# Altium project Trusters plate.PrjPcb
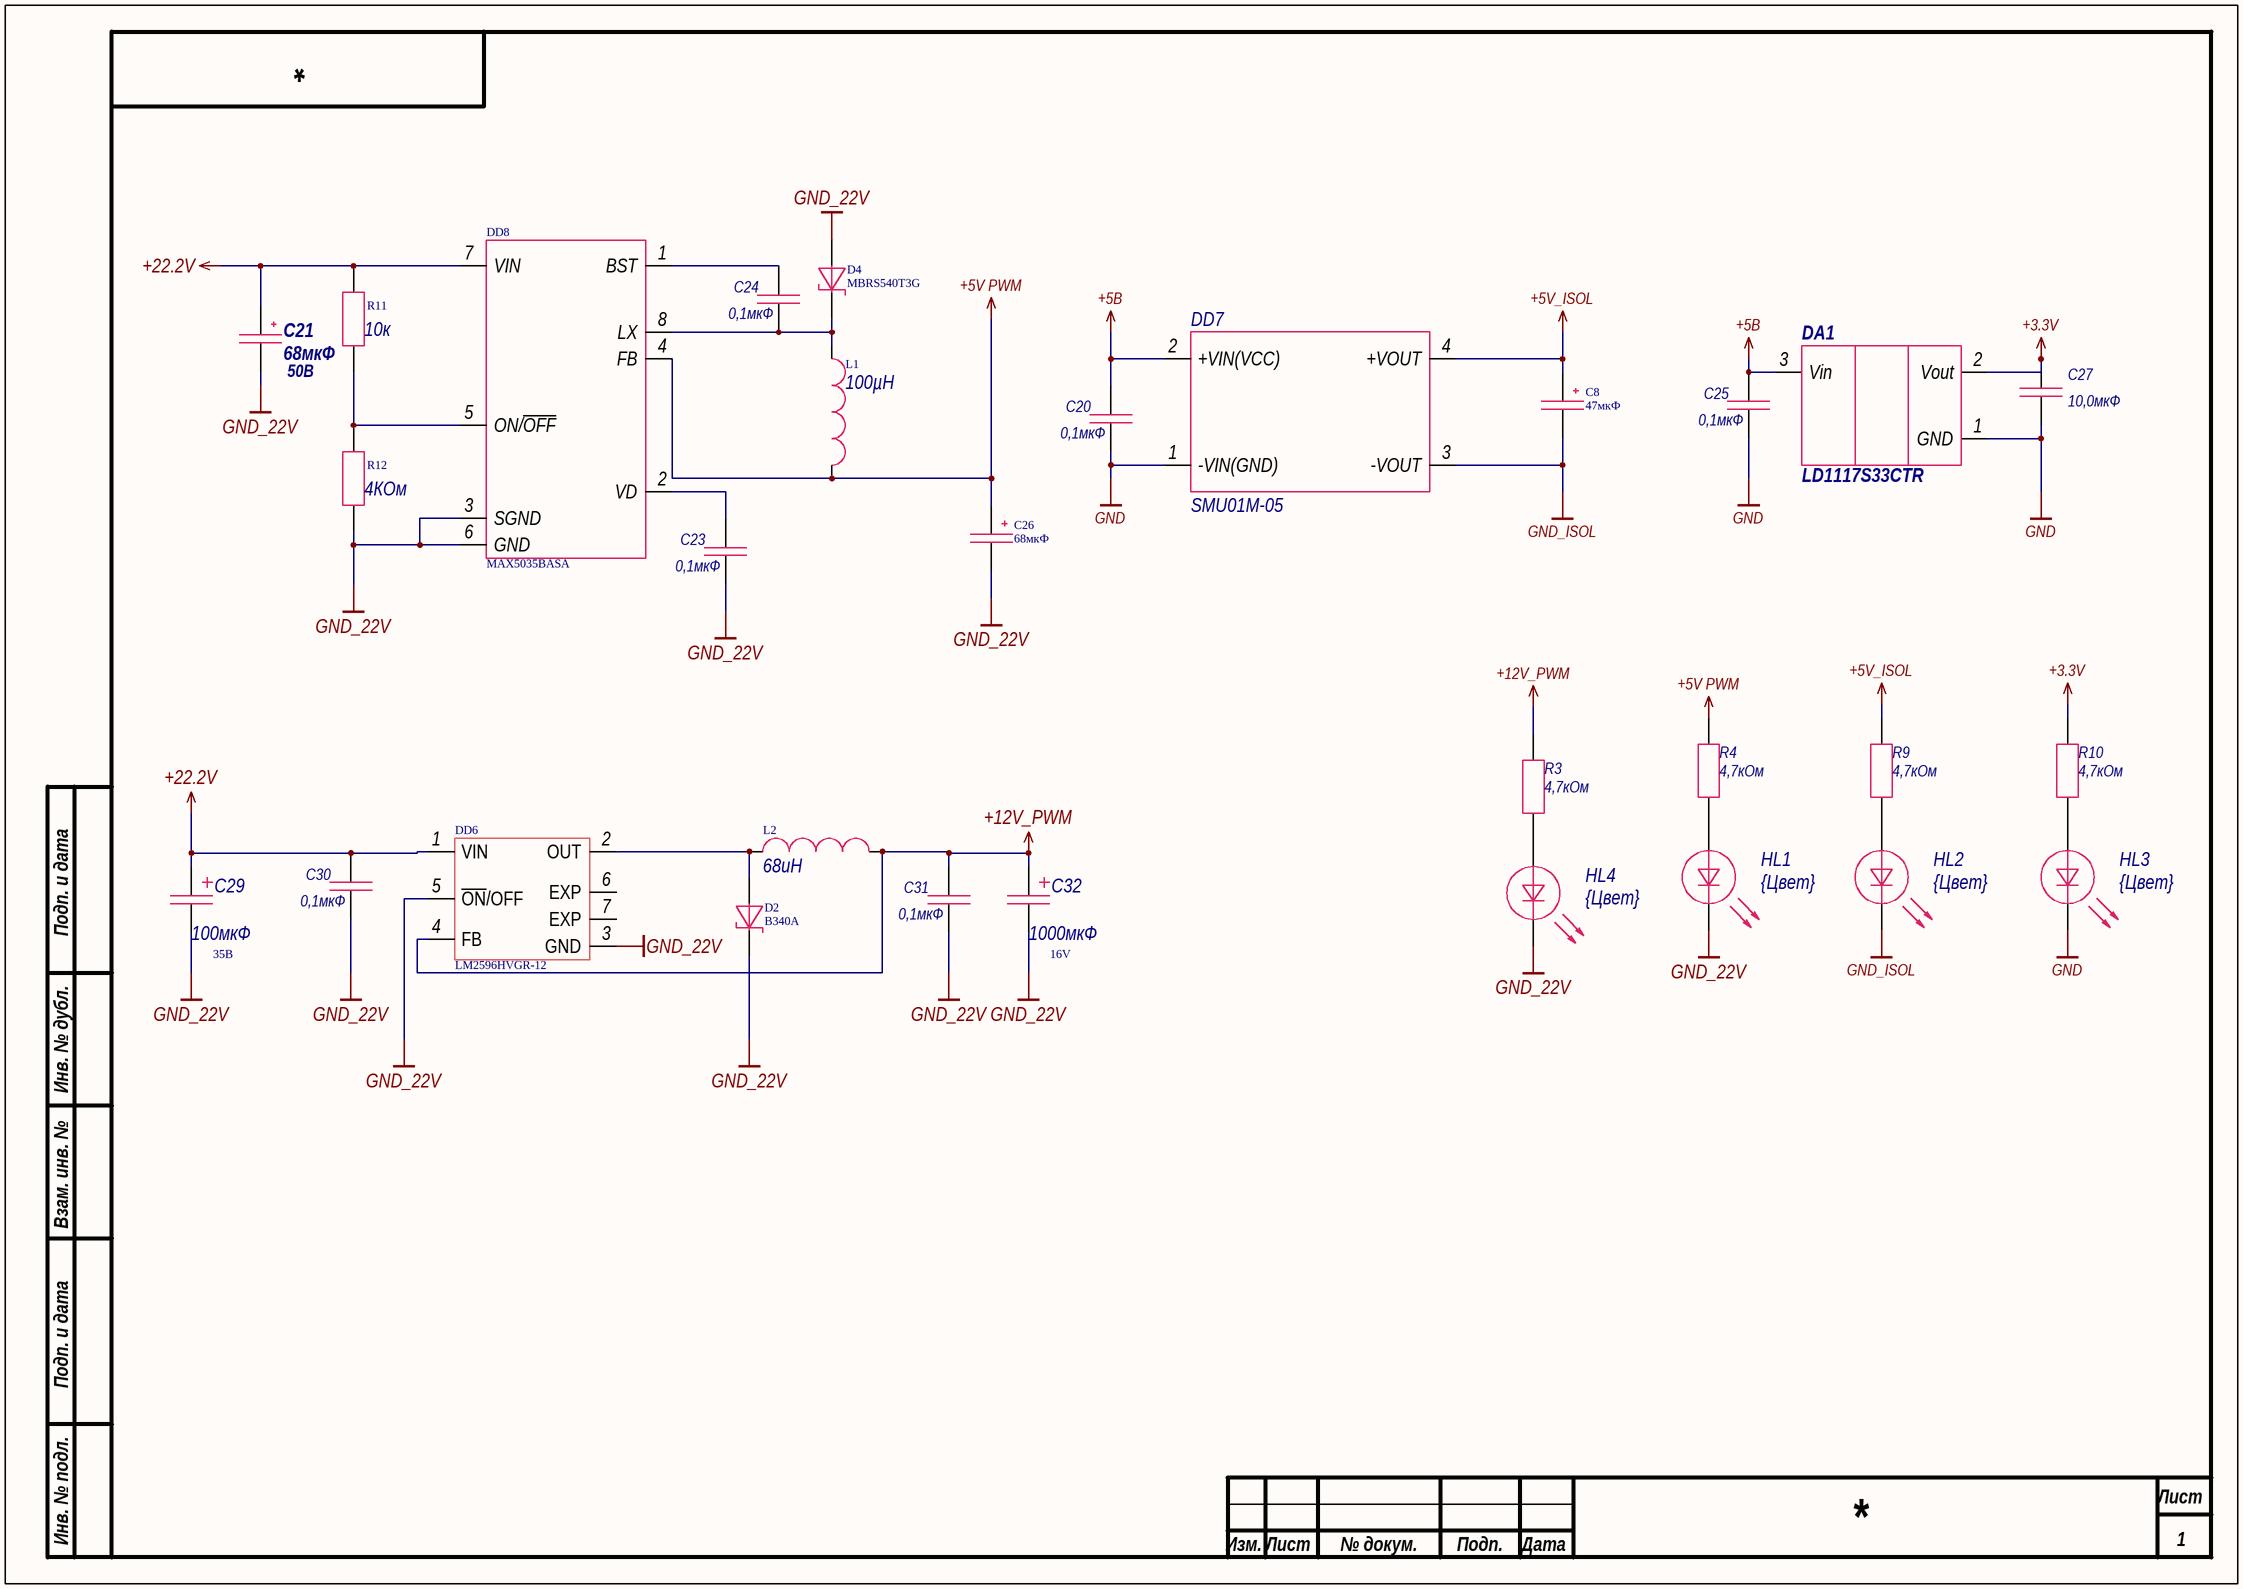
[diagram p0: power.SchDoc]
3 sheets, 101 parts. Net scope: flat (ports and power ports of the same name join across sheets).
Board file: thrusters.PcbDoc
Sheets:
  power.SchDoc
  conn.SchDoc
  mcu.SchDoc

## Sheet power.SchDoc
size 420 x 297 mm; SheetNumber: 1; SheetTotal: 3

### Parts
C8  47мкФ  [TC_B (3528)]
C20  value 0,1мкФ  [0603C]  (hidden comment: Capacitor)
C21  value 68мкФ  Parameter 1: 50В  [CAPPR65-350-1150X800X1250]  (hidden comment: 100uF)
C23  value 0,1мкФ  [0603C]  (hidden comment: Capacitor)
C24  value 0,1мкФ  [0603C]  (hidden comment: Capacitor)
C25  value 0,1мкФ  [0603C]  (hidden comment: Capacitor)
C26  68мкФ  [TC_D (7343)]
C27  value 10,0мкФ  [0603C]  (hidden comment: Capacitor)
C29  value 100мкФ  Rate: 35В  [THD12.5.25]  (hidden comment: 1uF)
C30  value 0,1мкФ  [0603C]  (hidden comment: Capacitor)
C31  value 0,1мкФ  [0603C]  (hidden comment: Capacitor)
C32  value 1000мкФ  Rate: 16V  [THD12.5.25]  (hidden comment: 1uF)
D2  B340A  [DIOM4326X23M]
D4  MBRS540T3G  [ONSC-SMC-2-403-03_V]
DA1  value LD1117S33CTR  [SOT223]  (hidden comment: LD1117S33)
DD6  LM2596HVGR-12  [VREG_LM2596S-3.3]
DD7  SMU01M-05  [DC-DC 5-5]
DD8  MAX5035BASA  [S8+5_L]
HL1  Color: {Цвет}  [0805D]
HL2  Color: {Цвет}  [0805D]
HL3  Color: {Цвет}  [0805D]
HL4  Color: {Цвет}  [0805D]
L1  value 100µH  [IND_VLS4012CX_4X4_TDK]  (hidden comment: Inductance)
L2  value 68uH  [IND_LQH32CN680K53L]  (hidden comment: Inductance)
R3  value 4,7кОм  [0603R]  (hidden comment: Resistor)
R4  value 4,7кОм  [0603R]  (hidden comment: Resistor)
R9  value 4,7кОм  [0603R]  (hidden comment: Resistor)
R10  value 4,7кОм  [0603R]  (hidden comment: Resistor)
R11  value 10к  [0805R]  (hidden comment: Resistor)
R12  value 4КОм  [0805R]  (hidden comment: Resistor)

### Nets
+3.3V: C27.1 DA1.2(Vout) R10.1
+5V PWM: C26.1 DD8.4(FB) L1.2 R4.1
+5V_ISOL: C8.1 DD7.4(+VOUT) R9.1
+5В: C20.1 C25.1 DA1.3(Vin) DD7.2(+VIN(VCC))
+12V_PWM: C31.1 C32.1 DD6.4(FB) L2.2 R3.1
+22.2V: C21.1 C29.1 C30.1 DD6.1(VIN) DD8.7(VIN) R11.2
GND: C20.2 C25.2 C27.2 DA1.1(GND) DD7.1(-VIN(GND)) HL3.2
GND_22V: C21.2 C23.2 C26.2 C29.2 C30.2 C31.2 C32.2 D2.2 D4.1 DD6.3(GND) DD6.5(~{ON}/OFF) DD8.3(SGND) DD8.6(GND) HL1.2 HL4.2 R12.1
GND_ISOL: C8.2 DD7.3(-VOUT) HL2.2
NetC23_1: C23.1 DD8.2(VD)
NetC24_1: C24.1 DD8.1(BST)
NetC24_2: C24.2 D4.2 DD8.8(LX) L1.1
NetD2_1: D2.1 DD6.2(OUT) L2.1
NetDD8_5: DD8.5(ON/~{OFF}) R11.1 R12.2
NetHL1_1: HL1.1 R4.2
NetHL2_1: HL2.1 R9.2
NetHL3_1: HL3.1 R10.2
NetHL4_1: HL4.1 R3.2

Not connected (* = marked no-connect by the designer): DD6 6(EXP) 7(EXP)

### Notes on the sheet
- Подп. и дата
- Инв. № дубл.
- Взам. инв. №
- Инв. № подл.
- Лист
- Изм.
- № докум.
- Подп.
- Дата

### Library data of the parts
C8 C26 = Capacitor_pol: Value: {Номинал}; Shop: https://www.chipdip.ru/product/tecap-68-mkf-10-v-tip-d-10-2
C21 = Capacitor_pol_100uF: Shop: https://www.chipdip.ru/product0/9000565885
C29 C32 = Capacitor_pol
  C29: Shop: https://www.chipdip.ru/product0/9000261772
  C32: Shop: https://www.chipdip.ru/product0/8007171953
D2 = CMP-1055-00390-1: Schottky Power Rectifier, 2-Pin SMC, Pb-Free, Tape and Reel; Manufacturer: On Semiconductor; PartNumber: MBRS540T3G; IFSM Max (A): 190; Shop: https://www.chipdip.ru/product/b340a; ComponentLink1URL: http://www.onsemi.com/; ComponentLink3URL: http://www.onsemi.com/pub_link/Collateral/403-03.PDF; ComponentLink1Description: Manufacturer URL; PackageVersion: Rev. E, 08/2005; Packing: Tape and Reel; ComponentLink2URL: http://www.onsemi.cn/pub_link/Collateral/MBRS540T3-D.PDF; RoHS: TRUE; DatasheetVersion: Rev. 8; Mounting Technology: Surface Mount; ComponentLink3Description: Package Specification; ComponentLink2Description: Datasheet; PackageDescription: 2-Pin Small Molded Package, J-Bend Lead, Body 5.845 x 6.855 mm; PackageReference: SMC-2-403-03
D4 = CMP-1055-00390-1: Schottky Power Rectifier, 2-Pin SMC, Pb-Free, Tape and Reel; Manufacturer: On Semiconductor; Configuration: Single; IFSM Max (A): 190; ComponentLink1URL: http://www.onsemi.com/; ComponentLink3URL: http://www.onsemi.com/pub_link/Collateral/403-03.PDF; ComponentLink1Description: Manufacturer URL; PackageVersion: Rev. E, 08/2005; Packing: Tape and Reel; ComponentLink2URL: http://www.onsemi.cn/pub_link/Collateral/MBRS540T3-D.PDF; RoHS: TRUE; DatasheetVersion: Rev. 8; Mounting Technology: Surface Mount; ComponentLink3Description: Package Specification; ComponentLink2Description: Datasheet; PartNumber: MBRS540T3G; PackageDescription: 2-Pin Small Molded Package, J-Bend Lead, Body 5.845 x 6.855 mm; PackageReference: SMC-2-403-03
DA1 = LD1117S33: Manufacturer: ST Microelectronics; Notice: Стабилизатор напряжения 3,3В; Rate: 0...15В; Datasheet: https://lib.chipdip.ru/168/DOC001168686.pdf; Shop: https://www.chipdip.ru/product/ld1117v33; Case: SOT223
DD6 = LM2596HVGR-12: MF: Texas Instruments; MP: LM2596S-3.3; Shop: https://www.chipdip.ru/product/lm2596hvgr-12; SnapEDA_Link: https://www.snapeda.com/parts/LM2596S-3.3/Texas+Instruments/view-part/?ref=snap; Availability: In Stock; Value: *; Price: None; Package: TO-263-5 Texas Instruments; Purchase-URL: https://pricing.snapeda.com/search/part/LM2596S-3.3/?ref=eda
DD7 = SMU01L-05: DC/DC преобразователь, 1Вт, вход 4.5-5.5В, выход 5В/200мА; MP: TME_1212S; Value: *; Availability: Unavailable; Price: None; Package: None
DD8 = MAX5035BASA+T: 1A, 76V, High-Efficiency MAXPower Step-Down DC-DC Converter, 5V output, 8-Pin SOIC, -40°C to +125°C, Pb-Free; ComponentLink2Description: Datasheet; Code_IPC: SOIC127P600-8; PackageDescription: 8-Pin Small-Outline IC, Narrow (0.15in), 1.27 mm Pitch, SOIC (N), Pb-Free; ComponentLink1URL: http://www.maxim-ic.com; PackageVersion: revC, 2010; Code_JEDEC: MS-012-AA; ComponentLink3URL: http://pdfserv.maxim-ic.com/package_dwgs/21-0041.PDF; DatasheetVersion: Rev 5, May-2011; ComponentLink2URL: http://datasheets.maxim-ic.com/en/ds/MAX5035.pdf; PackageReference: S8+5; ComponentLink1Description: Manufacturer URL; ComponentLink3Description: Package Specification
HL1-HL4 = LED: Manufacturer: -; Rate: -; Datasheet: -; Shop: -; Notice: -; Case: -
L1 L2 = Inductance
  L2: Shop: https://www.chipdip.ru/product0/8009279023

## Sheet conn.SchDoc
size A3; SheetNumber: 2; SheetTotal: 3
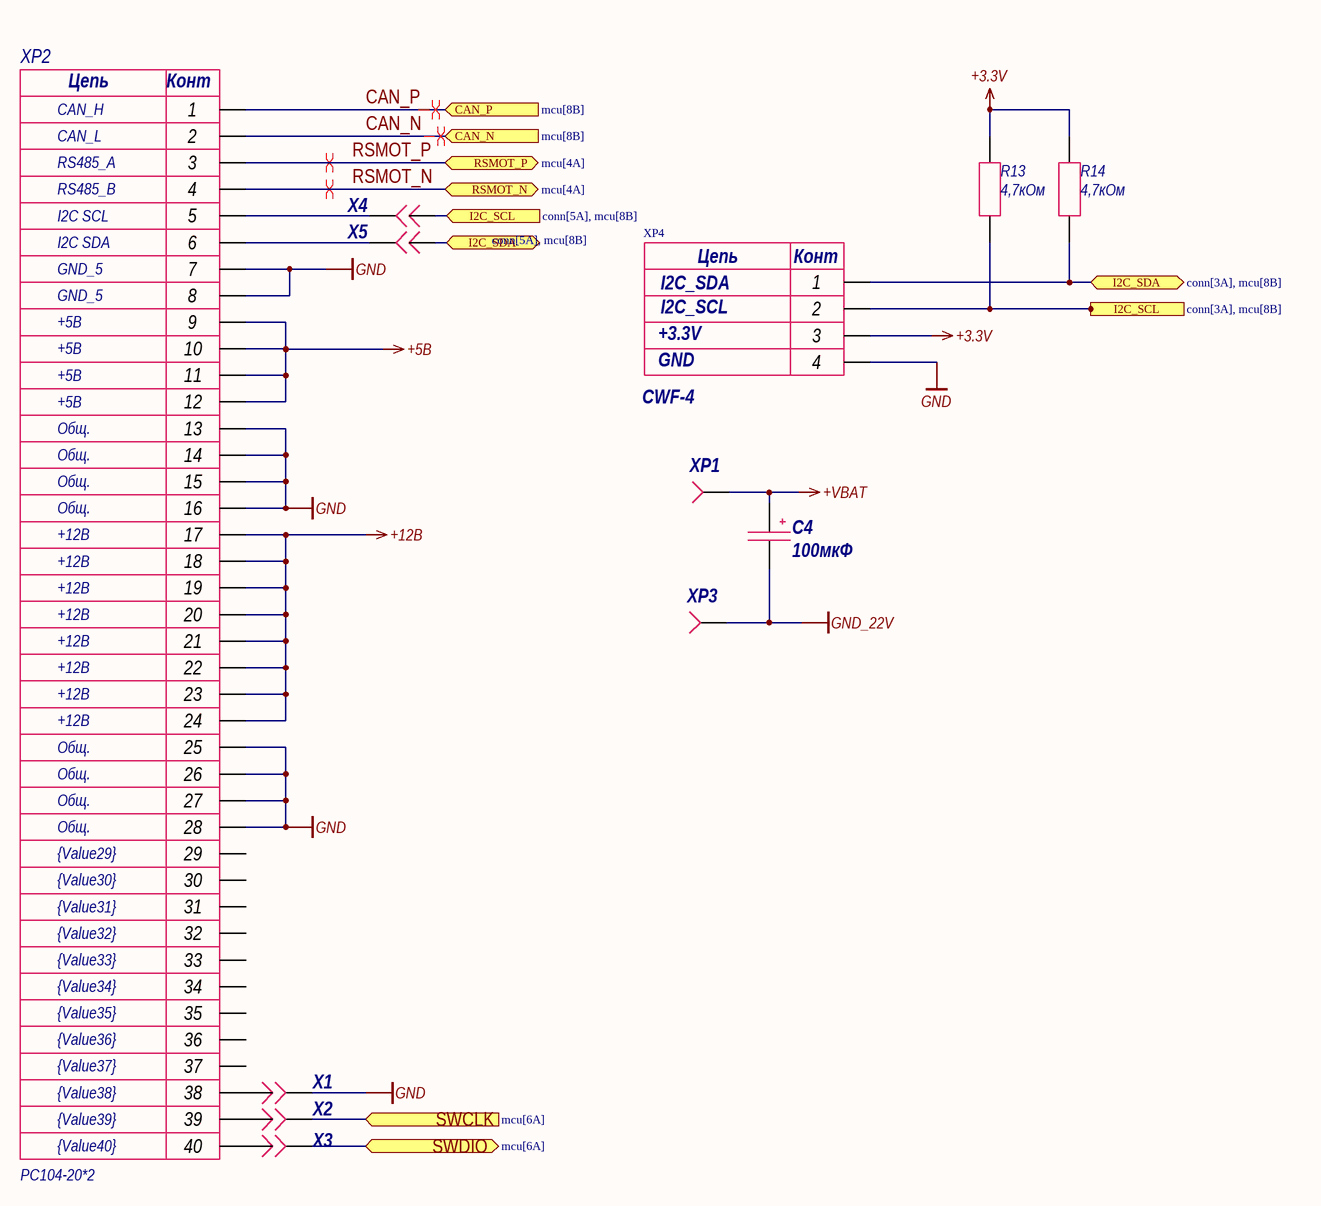
[diagram p1: conn.SchDoc]

### Parts
C4  value 100мкФ  [CAPPR65-350-1150X800X1250]  (hidden comment: 100uF)
R13  value 4,7кОм  [0603R]  (hidden comment: Resistor)
R14  value 4,7кОм  [0603R]  (hidden comment: Resistor)
X1  Jumper  [Fused Jumper]  (value not drawn)
X2  Jumper  [Fused Jumper]  (value not drawn)
X3  Jumper  [Fused Jumper]  (value not drawn)
X4  Jumper  [Fused Jumper]  (value not drawn)
X5  Jumper  [Fused Jumper]  (value not drawn)
XP1  номинал или название  [M3]  (value not drawn)
XP2  Value10: +5В  Value13: Общ.  Value17: +12В  Value1: CAN_H  Value2: CAN_L  Value3: RS485_A  Value4: RS485_B  Value5: I2C SCL  Value6: I2C SDA  Value7: GND_5  Value29: {Value29}  Value30: {Value30}  Value31: {Value31}  Value32: {Value32}  Value33: {Value33}  Value34: {Value34}  Value35: {Value35}  Value36: {Value36}  Value37: {Value37}  Value38: {Value38}  Value39: {Value39}  Value40: {Value40}  [PC - 104 20X2]  (hidden comment: PC104-20*2)
XP3  номинал или название  [M3]  (value not drawn)
XP4  Value1: I2C_SCL  Value2: I2C_SDA  Value3: +3.3V  Value4: GND  [CWF-4]  (hidden comment: CWF-4)

### Ports
CAN_N (in, see mcu[8B]), CAN_P (in, see mcu[8B]), I2C_SCL (in, see conn[5A], mcu[8B]), I2C_SCL (out, see conn[3A], mcu[8B]), I2C_SDA (bidir, see conn[3A], mcu[8B]), I2C_SDA (bidir, see conn[5A], mcu[8B]), RSMOT_N (bidir, see mcu[4A]), RSMOT_P (bidir, see mcu[4A]), SWCLK (in, see mcu[6A]), SWDIO (bidir, see mcu[6A])

### Nets
+3.3V: R13.1 R14.1 XP4.3
+5В: XP2.9 XP2.10 XP2.11 XP2.12
+12В: XP2.17 XP2.18 XP2.19 XP2.20 XP2.21 XP2.22 XP2.23 XP2.24
+VBAT: C4.1 XP1.1(M2,5)
GND: X1.1(M2,5) XP2.7 XP2.8 XP2.13 XP2.14 XP2.15 XP2.16 XP2.25 XP2.26 XP2.27 XP2.28 XP4.4
GND_22V: C4.2 XP3.1(M2,5)
CAN_N: XP2.2 ; port CAN_N
CAN_P: XP2.1 ; port CAN_P
RSMOT_N: XP2.4 ; port RSMOT_N
RSMOT_P: XP2.3 ; port RSMOT_P
SWCLK: X2.1(M2,5) ; port SWCLK
SWDIO: X3.1(M2,5) ; port SWDIO
NetR13_2: R13.2 X4.2(M2,5) XP4.2 ; port I2C_SCL
NetR14_2: R14.2 X5.2(M2,5) XP4.1 ; port I2C_SDA
NetX1_2: X1.2(M2,5) XP2.38
NetX2_2: X2.2(M2,5) XP2.39
NetX3_2: X3.2(M2,5) XP2.40
NetX4_1: X4.1(M2,5) XP2.5
NetX5_1: X5.1(M2,5) XP2.6

Not connected (* = marked no-connect by the designer): XP2 29 30 31 32 33 34 35 36 37

### Layout directives
differential pair: CAN_N, CAN_P, RSMOT_N, RSMOT_P

### Notes on the sheet
- (in symbol CWF-4) Цепь; Конт
- (in symbol PC104-20*2) Цепь; Конт

### Library data of the parts
C4 = Capacitor_pol_100uF: Shop: https://www.chipdip.ru/product0/9000565887
X1-X5 = Jumper: Manufacturer: производитель; Rate: уровень напряжений; Shop: магазин с самой дешевой ценой; Notice: перемычка; Datasheet: ссылка на даташит; Case: корпус
XP1 XP3 = 1pin: Manufacturer: производитель; Rate: уровень напряжений; Shop: магазин с самой дешевой ценой; Notice: примечания; Datasheet: ссылка на даташит; Case: корпус; Value: номинал или название
XP2 = PC104-20*2: Notice: PC104-40; Value: PC104-20*2; Value11: +5В; Value12: +5В; Value14: Общ.; Value15: Общ.; Value16: Общ.; Value18: +12В; Value8: GND_5; Value9: +5В; Value19: +12В; Value20: +12В; Value21: +12В; Value22: +12В; Value23: +12В; Value24: +12В; Value25: Общ.; Value26: Общ.; Value27: Общ.; Value28: Общ.
XP4 = CWF-4: Manufactore: Connfly; Notice: Вилка-мама 4 пина, шаг 2.5мм; Rate: 500В AC 1min; Case: корпус; Datasheet: https://lib.chipdip.ru/413/DOC001413777.pdf; Shop: https://www.chipdip.ru/product/cwf-4; Value: CWF-4

## Sheet mcu.SchDoc
size A1; SheetNumber: 3; SheetTotal: 3
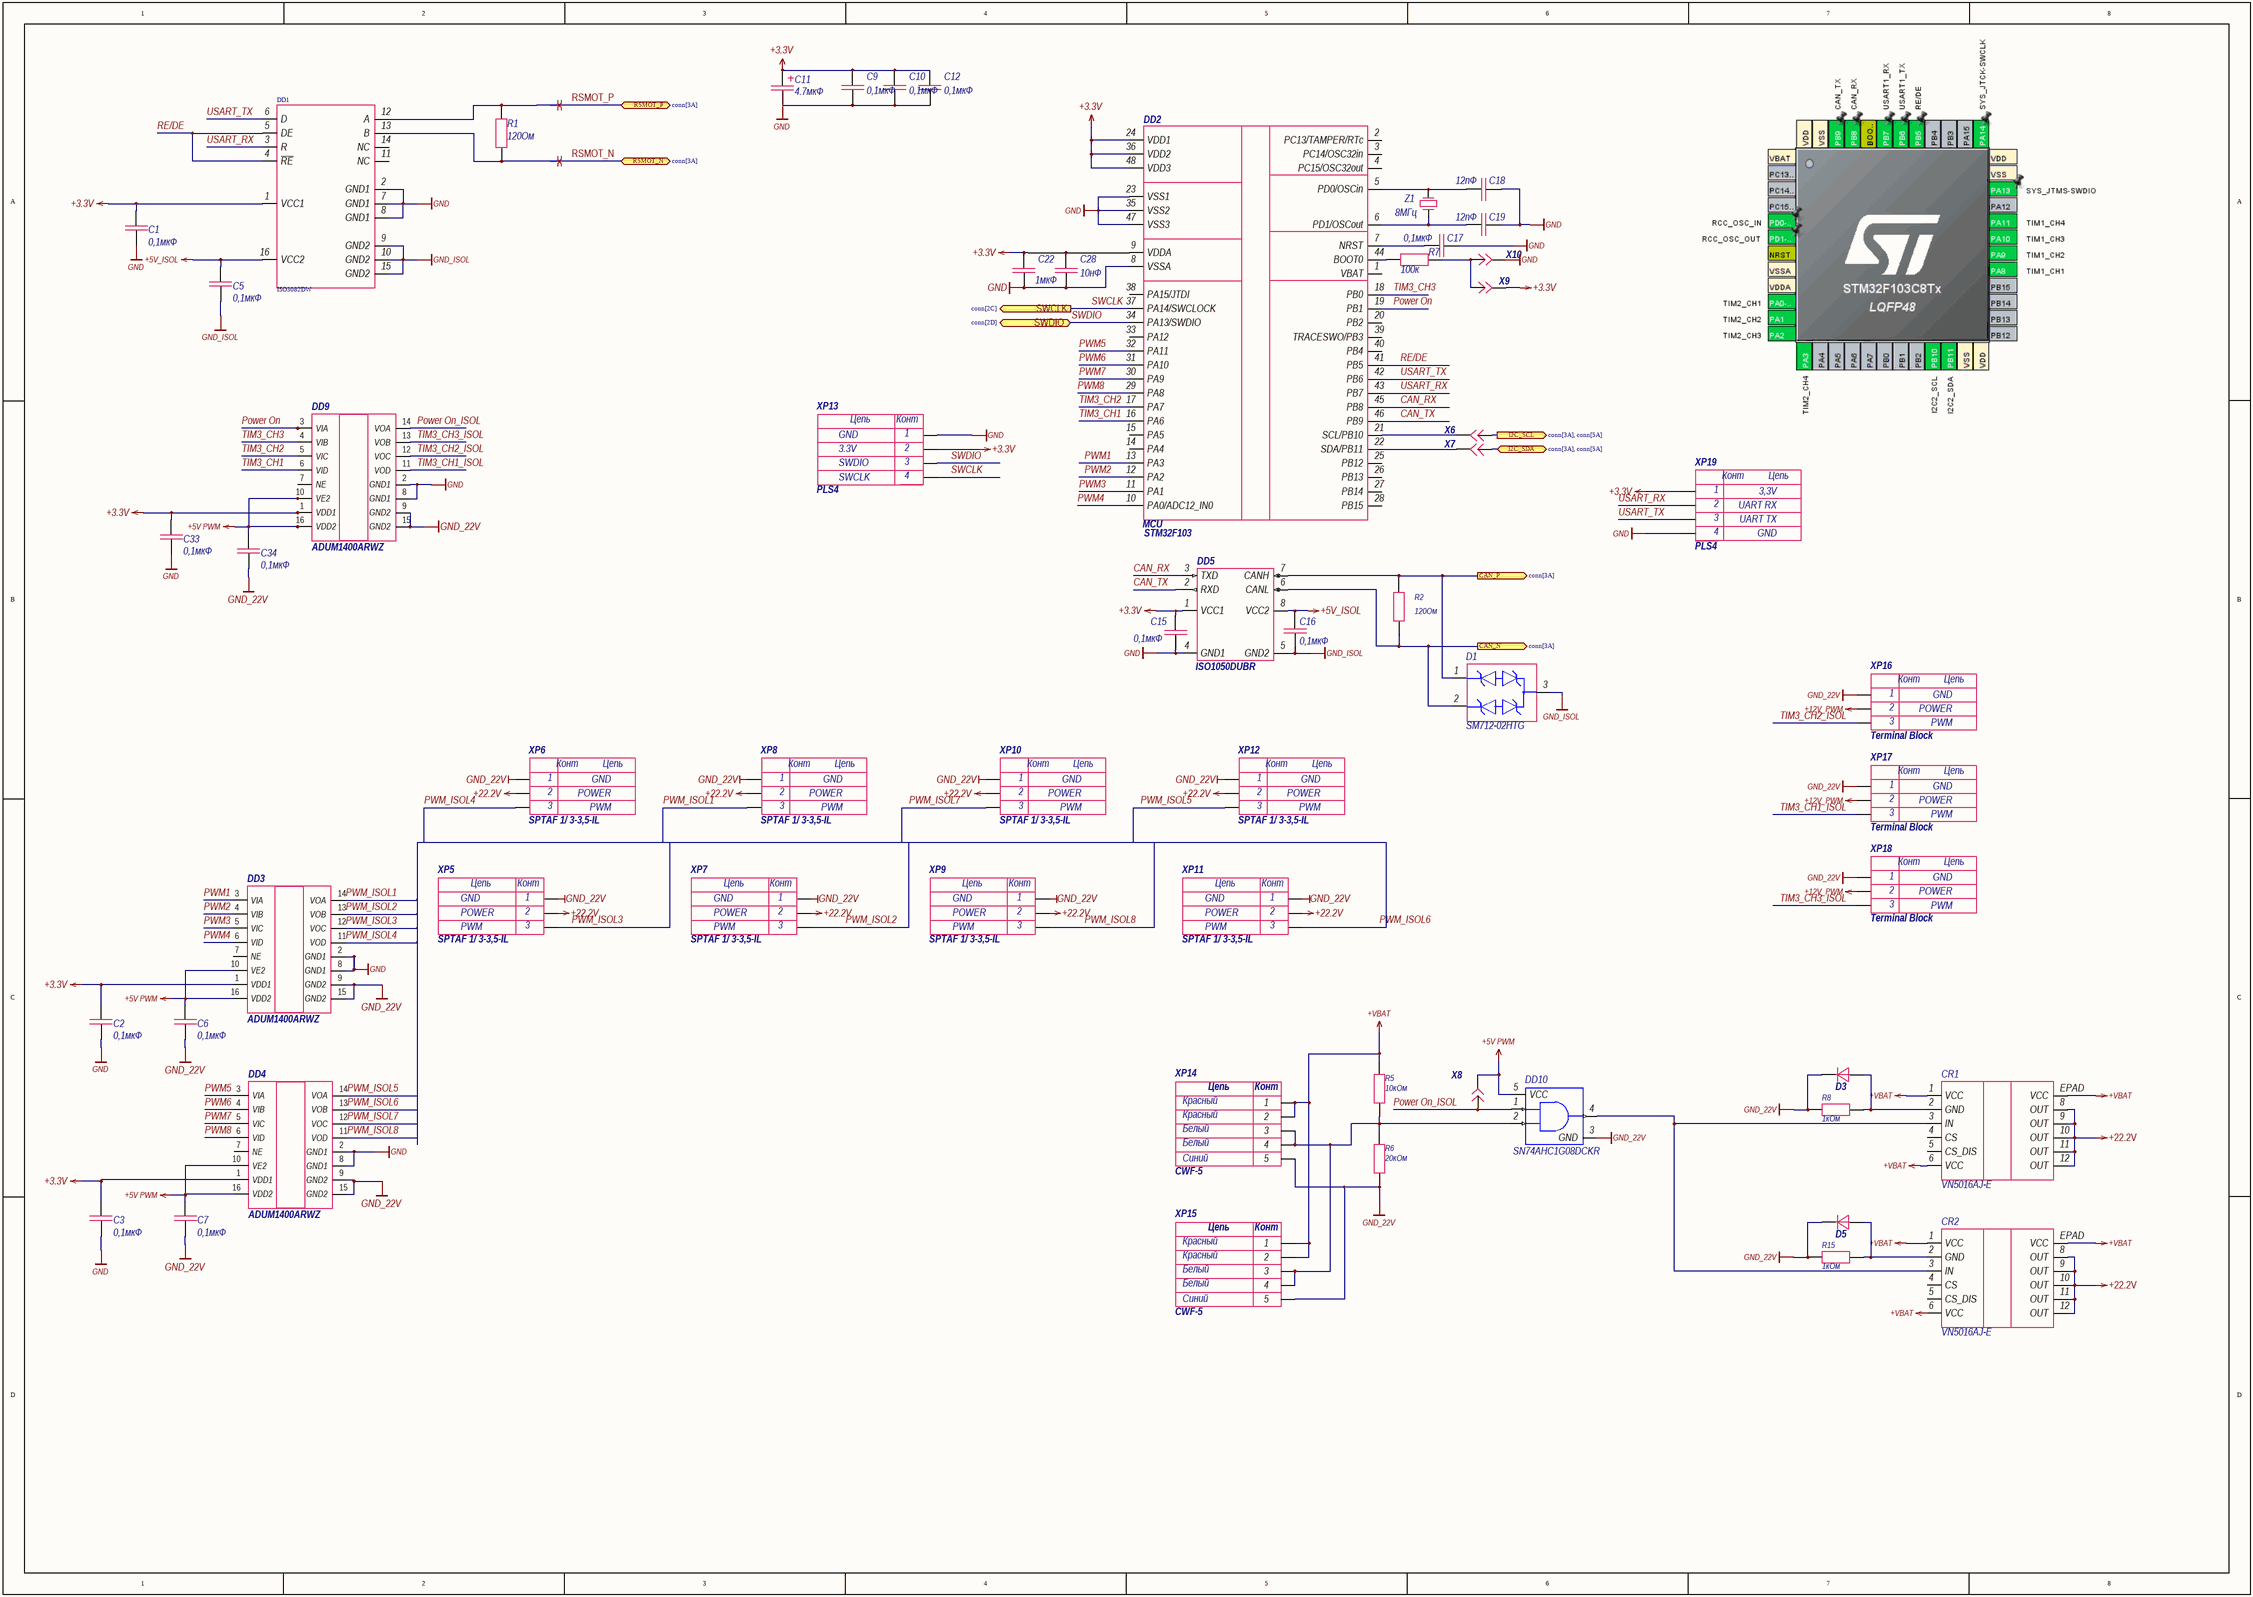
[diagram p2: mcu.SchDoc]

### Parts
C1  value 0,1мкФ  [0603C]  (hidden comment: Capacitor)
C2  value 0,1мкФ  [0603C]  (hidden comment: Capacitor)
C3  value 0,1мкФ  [0603C]  (hidden comment: Capacitor)
C5  value 0,1мкФ  [0603C]  (hidden comment: Capacitor)
C6  value 0,1мкФ  [0603C]  (hidden comment: Capacitor)
C7  value 0,1мкФ  [0603C]  (hidden comment: Capacitor)
C9  value 0,1мкФ  [0603C]  (hidden comment: Capacitor)
C10  value 0,1мкФ  [0603C]  (hidden comment: Capacitor)
C11  value 4.7мкФ  [TC_A (3216)]  (hidden comment: 1uF)
C12  value 0,1мкФ  [0603C]  (hidden comment: Capacitor)
C15  value 0,1мкФ  [0603C]  (hidden comment: Capacitor)
C16  value 0,1мкФ  [0603C]  (hidden comment: Capacitor)
C17  value 0,1мкФ  [0603C]  (hidden comment: Capacitor)
C18  value 12пФ  [0603C]  (hidden comment: Capacitor)
C19  value 12пФ  [0603C]  (hidden comment: Capacitor)
C22  value 1мкФ  [0603C]  (hidden comment: Capacitor)
C28  value 10нФ  [0603C]  (hidden comment: Capacitor)
C33  value 0,1мкФ  [0603C]  (hidden comment: Capacitor)
C34  value 0,1мкФ  [0603C]  (hidden comment: Capacitor)
CR1  VN5016AJ-E  [PowerSSO-12_STM]
CR2  VN5016AJ-E  [PowerSSO-12_STM]
D1  SM712-02HTG  [FP-SM712-MFG]
D3  Diod_1  [DIOM4326X23M]  (value not drawn)
D5  Diod_1  [DIOM4326X23M]  (value not drawn)
DD1  ISO3082DW  [DW0016B_L]
DD2  Value1: MCU  [LQFP48]  (hidden comment: STM32F103)
DD3  ADUM1400ARWZ  [ADI-RW-16_M]
DD4  ADUM1400ARWZ  [ADI-RW-16_M]
DD5  ISO1050DUBR  [DUB0008A_M]
DD9  ADUM1400ARWZ  [ADI-RW-16_M]
DD10  SN74AHC1G08DCKR  [SOT65P210X110-5N]
R1  value 120Ом  [0603R]  (hidden comment: Resistor)
R2  value 120Ом  [0603R]  (hidden comment: Resistor)
R5  value 10кОм  [0603R]  (hidden comment: Resistor)
R6  value 20кОм  [0603R]  (hidden comment: Resistor)
R7  value 100к  [0603R]  (hidden comment: Resistor)
R8  value 1кОм  [0603R]  (hidden comment: Resistor)
R15  value 1кОм  [0603R]  (hidden comment: Resistor)
X6  Jumper  [Fused Jumper]  (value not drawn)
X7  Jumper  [Fused Jumper]  (value not drawn)
X8  Jumper  [Fused Jumper]  (value not drawn)
X9  Jumper  [Fused Jumper]  (value not drawn)
X10  Jumper  [Fused Jumper]  (value not drawn)
XP5  Value3: PWM  Value2: POWER  Value1: GND  [STAFFFFFF]  (hidden comment: SPTAF 1/ 3-3,5-IL)
XP6  Value3: PWM  Value2: POWER  Value1: GND  [STAFFFFFF]  (hidden comment: SPTAF 1/ 3-3,5-IL)
XP7  Value3: PWM  Value2: POWER  Value1: GND  [STAFFFFFF]  (hidden comment: SPTAF 1/ 3-3,5-IL)
XP8  Value3: PWM  Value2: POWER  Value1: GND  [STAFFFFFF]  (hidden comment: SPTAF 1/ 3-3,5-IL)
XP9  Value3: PWM  Value2: POWER  Value1: GND  [STAFFFFFF]  (hidden comment: SPTAF 1/ 3-3,5-IL)
XP10  Value3: PWM  Value2: POWER  Value1: GND  [STAFFFFFF]  (hidden comment: SPTAF 1/ 3-3,5-IL)
XP11  Value3: PWM  Value2: POWER  Value1: GND  [STAFFFFFF]  (hidden comment: SPTAF 1/ 3-3,5-IL)
XP12  Value3: PWM  Value2: POWER  Value1: GND  [STAFFFFFF]  (hidden comment: SPTAF 1/ 3-3,5-IL)
XP13  Value3: SWDIO  Value2: SWCLK  Value4: GND  Value1: 3.3V  [PLS4]  (hidden comment: PLS4)
XP14  Value1: Красный  Value3: Белый  Value5: Синий  [CWF-5]  (hidden comment: CWF-5)
XP15  Value1: Красный  Value3: Белый  Value5: Синий  [CWF-5]  (hidden comment: CWF-5)
XP16  value Terminal Block  Value3: PWM  Value2: POWER  Value1: GND  [term3pos]  (hidden comment: Term)
XP17  value Terminal Block  Value3: PWM  Value2: POWER  Value1: GND  [term3pos]  (hidden comment: Term)
XP18  value Terminal Block  Value3: PWM  Value2: POWER  Value1: GND  [term3pos]  (hidden comment: Term)
XP19  Value3: UART TX  Value2: UART RX  Value4: GND  Value1: 3,3V  [PLS4]  (hidden comment: PLS4)
Z1  value 8МГц  [NX3225GD]  (hidden comment: XTAL)

### Ports
CAN_N (out, see conn[3A]), CAN_P (out, see conn[3A]), I2C_SCL (out, see conn[3A], conn[5A]), I2C_SDA (bidir, see conn[3A], conn[5A]), RSMOT_N (bidir, see conn[3A]), RSMOT_P (bidir, see conn[3A]), SWCLK (out, see conn[2C]), SWDIO (bidir, see conn[2D])

### Nets
+3.3V: C1.1 C2.1 C3.1 C9.1 C10.1 C11.1 C12.1 C15.1 C22.2 C28.2 C33.1 DD1.1(VCC1) DD2.9(VDDA) DD2.24(VDD1) DD2.36(VDD2) DD2.48(VDD3) DD3.1(VDD1) DD4.1(VDD1) DD5.1(VCC1) DD9.1(VDD1) X9.1(M2,5) XP13.2 XP19.1
+5V PWM: C6.1 C7.1 C34.1 DD3.10(VE2) DD3.16(VDD2) DD4.10(VE2) DD4.16(VDD2) DD9.10(VE2) DD9.16(VDD2) DD10.5(VCC) X8.1(M2,5)
+5V_ISOL: C5.1 C16.1 DD1.16(VCC2) DD5.8(VCC2)
+12V_PWM: XP16.2 XP17.2 XP18.2
+22.2V: CR1.8(OUT) CR1.9(OUT) CR1.10(OUT) CR1.11(OUT) CR1.12(OUT) CR2.8(OUT) CR2.9(OUT) CR2.10(OUT) CR2.11(OUT) CR2.12(OUT) XP5.2 XP6.2 XP7.2 XP8.2 XP9.2 XP10.2 XP11.2 XP12.2
+VBAT: CR1.1(VCC) CR1.6(VCC) CR1.EPAD(VCC) CR2.1(VCC) CR2.6(VCC) CR2.EPAD(VCC) R5.2 XP14.1 XP14.2 XP15.1 XP15.2
GND: C1.2 C2.2 C3.2 C9.2 C10.2 C11.2 C12.2 C15.2 C17.1 C18.1 C19.1 C22.1 C28.1 C33.2 DD1.2(GND1) DD1.7(GND1) DD1.8(GND1) DD2.8(VSSA) DD2.23(VSS1) DD2.35(VSS2) DD2.47(VSS3) DD3.2(GND1) DD3.8(GND1) DD4.2(GND1) DD4.8(GND1) DD5.4(GND1) DD9.2(GND1) DD9.8(GND1) X10.1(M2,5) XP13.1 XP19.4
GND_22V: C6.2 C7.2 C34.2 D3.2 D5.2 DD3.9(GND2) DD3.15(GND2) DD4.9(GND2) DD4.15(GND2) DD9.9(GND2) DD9.15(GND2) DD10.3(GND) R6.1 R8.1 R15.1 XP5.1 XP6.1 XP7.1 XP8.1 XP9.1 XP10.1 XP11.1 XP12.1 XP14.5 XP15.5 XP16.1 XP17.1 XP18.1
GND_ISOL: C5.2 C16.2 D1.3 DD1.9(GND2) DD1.10(GND2) DD1.15(GND2) DD5.5(GND2)
CAN_N: D1.2 DD5.6(CANL) R2.2 ; port CAN_N
CAN_P: D1.1 DD5.7(CANH) R2.1 ; port CAN_P
CAN_RX: DD2.45(PB8) DD5.3(TXD)
CAN_TX: DD2.46(PB9) DD5.2(RXD)
Power On: DD2.19(PB1) DD9.3(VIA)
Power On_ISOL: DD9.14(VOA) DD10.1(A) X8.2(M2,5)
PWM1: DD2.13(PA3) DD3.3(VIA)
PWM2: DD2.12(PA2) DD3.4(VIB)
PWM3: DD2.11(PA1) DD3.5(VIC)
PWM4: DD2.10(PA0/ADC12_IN0) DD3.6(VID)
PWM5: DD2.32(PA11) DD4.3(VIA)
PWM6: DD2.31(PA10) DD4.4(VIB)
PWM7: DD2.30(PA9) DD4.5(VIC)
PWM8: DD2.29(PA8) DD4.6(VID)
PWM_ISOL1: DD3.14(VOA) XP8.3
PWM_ISOL2: DD3.13(VOB) XP7.3
PWM_ISOL3: DD3.12(VOC) XP5.3
PWM_ISOL4: DD3.11(VOD) XP6.3
PWM_ISOL5: DD4.14(VOA) XP12.3
PWM_ISOL6: DD4.13(VOB) XP11.3
PWM_ISOL7: DD4.12(VOC) XP10.3
PWM_ISOL8: DD4.11(VOD) XP9.3
RE/DE: DD1.4(~{RE}) DD1.5(DE) DD2.41(PB5)
RSMOT_N: DD1.13(B) R1.1 ; port RSMOT_N
RSMOT_P: DD1.12(A) R1.2 ; port RSMOT_P
SWCLK: DD2.37(PA14/SWCLOCK) XP13.4 ; port SWCLK
SWDIO: DD2.34(PA13/SWDIO) XP13.3 ; port SWDIO
TIM3_CH1: DD2.16(PA6) DD9.6(VID)
TIM3_CH1_ISOL: DD9.11(VOD) XP17.3
TIM3_CH2: DD2.17(PA7) DD9.5(VIC)
TIM3_CH2_ISOL: DD9.12(VOC) XP16.3
TIM3_CH3: DD2.18(PB0) DD9.4(VIB)
TIM3_CH3_ISOL: DD9.13(VOB) XP18.3
USART_RX: DD1.3(R) DD2.43(PB7) XP19.2
USART_TX: DD1.6(D) DD2.42(PB6) XP19.3
NetC17_2: C17.2 DD2.7(NRST)
NetC18_2: C18.2 DD2.5(PD0/OSCin) Z1.2
NetC19_2: C19.2 DD2.6(PD1/OSCout) Z1.1
NetCR1_2: CR1.2(GND) D3.1 R8.2
NetCR1_3: CR1.3(IN) CR2.3(IN) DD10.4(Y)
NetCR2_2: CR2.2(GND) D5.1 R15.2
NetDD2_21: DD2.21(SCL/PB10) X6.1(M2,5)
NetDD2_22: DD2.22(SDA/PB11) X7.1(M2,5)
NetDD2_44: DD2.44(BOOT0) R7.1
NetDD10_2: DD10.2(B) R5.1 R6.2 XP14.3 XP14.4 XP15.3 XP15.4
NetR7_2: R7.2 X9.2(M2,5) X10.2(M2,5)
NetR13_2: X6.2(M2,5) ; port I2C_SCL
NetR14_2: X7.2(M2,5) ; port I2C_SDA

Not connected (* = marked no-connect by the designer): CR1 4(CS) 5(CS_DIS); CR2 4(CS) 5(CS_DIS); DD1 11(NC) 14(NC); DD2 1(VBAT) 2(PC13/TAMPER/RTc) 3(PC14/OSC32in) 4(PC15/OSC32out) 14(PA4) 15(PA5) 20(PB2) 25(PB12) 26(PB13) 27(PB14) 28(PB15) 33(PA12) 38(PA15/JTDI) 39(TRACESWO/PB3) 40(PB4); DD3 7(NE); DD4 7(NE); DD9 7(NE)

### Layout directives
differential pair: RSMOT_N, RSMOT_P

### Notes on the sheet
- (in symbol CWF-5) Цепь; Конт
- (in symbol PLS4) Цепь; Конт
- (in symbol SPTAF 1/ 3-3,5-IL) Цепь; Конт
- (in symbol Term) Конт; Цепь

### Library data of the parts
C11 = Capacitor_pol
CR1 CR2 = VN5016AJ-E: No Description Available; Mfr_Name: STMicroelectronics; Type: DEV; Copyright: Copyright (C) 2022 Ultra Librarian. All rights reserved.; Manufacturer_Part_Number: VN5016AJ-E; RefDes: RefDes
D1 = SM712-02HTG: TVS DIODE 12V 31V SOT23-3; Leakage Current: 20uA; Polarity: Bidirectional; Breakdown Voltage: 13.3V; Max Power Dissipation: 600W; Number of Channels: 2; Max Surge Current: 19A; Capacitance: 75pF; Power Line Protection: No; Element Configuration: Dual; Number of Pins: 3; Radiation Hardening: No; Clamping Voltage: 31V; Mount: Surface Mount; Reverse Standoff Voltage: 12V; Peak Pulse Power: 600W; Lead Free: Lead Free; Direction: Bidirectional; Packaging: Tape and Reel; Case/Package: SOT-23-3; Number of Bidirectional Channels: 2; Termination: SMD/SMT; Max Operating Temperature: 125°C; Min Breakdown Voltage: 13.3V; Depth: 1.4mm; Package Quantity: 3000; Working Voltage: 12V; Length: 3.04mm; Peak Pulse Current: 19A; Composition: Zener; Min Operating Temperature: -40°C
D3 D5 = Diod_1: Value: {Номинал}; Datasheet: https://www.terraelectronica.ru/pdf/show?pdf_file=http%253A%252F%252Fwww.farnell.com%252Fdatasheets%252F1480487.pdf; Shop: https://www.terraelectronica.ru/product/1932087
DD1 = ISO3082: Isolated RS-485 Transceiver, 0.2 Mbps, 5 V, Half Duplex, -40 to 85 degC, 16-pin SOIC (DW), Green (RoHS & no Sb/Br); Manufacturer: Texas Instruments; Fault Protection(V): -9 to 14; Fail Safe: Idle, Open, Short; # of TX/RX: 1 TX / 1 RX; Isolated: Yes; ICC(Max)(mA): 15; ESD(kV): 16; Number of Nodes: 256; Drivers Per Package: 1; Rating: Catalog; Common Mode Range: -7 to 12; Supply Voltage(s)(V): 5; Signaling Rate(Mbps): 0.2; Eco-Plan: Green (RoHS & no Sb/Br); ComponentLink2URL: http://www.ti.com/litv/pdf/msoi003g; DatasheetVersion: SLOS581E; SubFamily: RS-485; PartNumber: ISO3082DW; Duplex: Half; PackageDescription: 16-Pin Small Outline Integrated Circuit, 10.3 x 7.5 mm, Pitch 1.27 mm Pitch; ComponentLink1Description: Datasheet; ComponentLink1URL: http://www.ti.com/general/docs/lit/getliterature.tsp?genericPartNumber=ISO3082&fileType=pdf; Code_JEDEC: MS-013-AA; PackageReference: DW0016B; ComponentLink2Description: Package Specification; Mounting Technology: Surface Mount; Receivers Per Package: 1; PackageVersion: revG, Jan-2011
DD2 = STM32F103_48pin: Manufacturer: ST Microelectronics; Rate: -0,3...4,0В; Shop: магазин с самой дешевой ценой; Notice: 48 пиновая версия STM32F103; Datasheet: http://www.st.com/content/ccc/resource/technical/document/datasheet/33/d4/6f/1d/df/0b/4c/6d/CD00161566.pdf/files/CD00161566.pdf/jcr:content/translations/en.CD00161566.pdf; Case: корпус; Value: STM32F103
DD3 DD4 DD9 = ADUM1400ARWZ-RL: Четырехканальный цифровой изолятор; Shop: https://www.chipdip.ru/product/adum1400arwz
DD5 = ISO1050DUBR: Isolated CAN Transceiver, -55 to 105 degC, 8-pin SOP (DUB), Green (RoHS & no Sb/Br); Manufacturer: Texas Instruments; Rating: Catalog; Isolated: Yes; Drivers Per Package: 1; PackageReference: DUB0008A; PartNumber: ISO1050DUBR; ComponentLink2Description: Package Specification; ComponentLink1Description: Datasheet; Mounting Technology: Surface Mount; ComponentLink1URL: http://www.ti.com/general/docs/lit/getliterature.tsp?genericPartNumber=ISO1050&fileType=pdf; ComponentLink2URL: http://www.ti.com/litv/pdf/mpds247b; Eco-Plan: Green (RoHS & no Sb/Br); PackageDescription: 8-Pin Small Outline Package 2.54 mm Pitch; PackageVersion: revC, May-2006; SubFamily: CAN; DatasheetVersion: SLLS983E
DD10 = SN74AHC1G08DCKR: Single 2-Input Positive-AND Gate 5-SC70 -55 to 125; MP: SN74AHC1G08DCKR; Availability: Unavailable; Value: *; Package: None; Price: None; Shop: https://www.chipdip.ru/product/sn74lvc1g08dckr
X6-X10 = Jumper: as X1 on sheet conn; Datasheet: ссылка на даташит; Case: корпус
XP5-XP12 = SPTAF 1/ 3-3,5-IL: Manufacturer: Connfly; Notice: Вилка штырьевая 3 пина, шаг 2,54мм; Rate: 500В AC 1min; Datasheet: https://lib.chipdip.ru/227/DOC000227157.pdf; Shop: https://www.chipdip.ru/product/pls-3; Value: SPTAF 1/ 3-3,5-IL
XP13 XP19 = PLS4: Manufacturer: Connfly; Notice: Вилка штырьевая 4 пина, шаг 2,54мм; Rate: 500В AC 1min; Datasheet: https://lib.chipdip.ru/227/DOC000227157.pdf; Shop: https://www.chipdip.ru/product/pls-4; Value: PLS4
XP14 XP15 = CWF-5: Notice: Вилка-мама 5 пинов, шаг 2.5мм; Rate: 500В AC 1min; Case: корпус; Datasheet: https://lib.chipdip.ru/413/DOC001413777.pdf; Manufactore: CWF-5; Shop: https://www.chipdip.ru/product/cwf-5; Value: CWF-5; Value2: Красный; Value4: Белый
XP16-XP18 = Term: Manufacturer: Connfly; Notice: Вилка штырьевая 3 пина, шаг 2,54мм; Rate: 500В AC 1min; Datasheet: https://lib.chipdip.ru/227/DOC000227157.pdf; Shop: https://www.chipdip.ru/product/pls-3
Z1 = XTAL: Shop: https://www.chipdip.ru/product0/8001877433

## Nets that join several sheets
+3.3V: power (C27.1 DA1.2 R10.1), conn (R13.1 R14.1 XP4.3), mcu (23 pins)
+5V PWM: power (C26.1 DD8.4 L1.2 R4.1), mcu (11 pins)
+5V_ISOL: power (C8.1 DD7.4 R9.1), mcu (C5.1 C16.1 DD1.16 DD5.8)
+5В: power (C20.1 C25.1 DA1.3 DD7.2), conn (XP2.9 XP2.10 XP2.11 XP2.12)
+12V_PWM: power (5 pins), mcu (XP16.2 XP17.2 XP18.2)
+22.2V: power (6 pins), mcu (18 pins)
+VBAT: conn (C4.1 XP1.1), mcu (11 pins)
GND: power (6 pins), conn (12 pins), mcu (31 pins)
GND_22V: power (16 pins), conn (C4.2 XP3.1), mcu (28 pins)
GND_ISOL: power (C8.2 DD7.3 HL2.2), mcu (7 pins)
CAN_N: conn (XP2.2), mcu (D1.2 DD5.6 R2.2)
CAN_P: conn (XP2.1), mcu (D1.1 DD5.7 R2.1)
NetR13_2: conn (R13.2 X4.2 XP4.2), mcu (X6.2)
NetR14_2: conn (R14.2 X5.2 XP4.1), mcu (X7.2)
RSMOT_N: conn (XP2.4), mcu (DD1.13 R1.1)
RSMOT_P: conn (XP2.3), mcu (DD1.12 R1.2)
SWCLK: conn (X2.1), mcu (DD2.37 XP13.4)
SWDIO: conn (X3.1), mcu (DD2.34 XP13.3)